# Altium schematic sheet Register.SchDoc
size A; Author: E. Sims; Organization: Let's Build Rockets Inc.; SheetNumber: 5; SheetTotal: 11
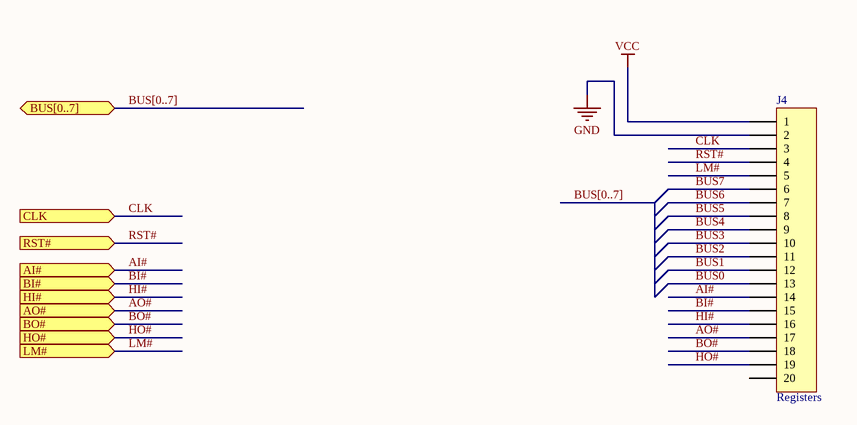
[diagram p0: Register.SchDoc]

## Parts
J4  Registers  [HDR1X20]

## Ports
AI# (in), AO# (in), BI# (in), BO# (in), BUS[0..7] (bidir), CLK (in), HI# (in), HO# (in), LM# (in), RST# (in)

## Nets
GND: J4.2
VCC: J4.1
AI#: J4.14 ; port AI#
AO#: J4.17 ; port AO#
BI#: J4.15 ; port BI#
BO#: J4.18 ; port BO#
BUS0: J4.13
BUS1: J4.12
BUS2: J4.11
BUS3: J4.10
BUS4: J4.9
BUS5: J4.8
BUS6: J4.7
BUS7: J4.6
CLK: J4.3 ; port CLK
HI#: J4.16 ; port HI#
HO#: J4.19 ; port HO#
LM#: J4.5 ; port LM#
RST#: J4.4 ; port RST#

Not connected (* = marked no-connect by the designer): J4 20

## Buses and harness runs
bus BUS[0..7]
bus BUS[0..7] = port BUS[0..7]

## Notes on the sheet
- Let's Build Rocket's Inc. Modular Paylaod System Based on TMP-010 Rev
  For more information visit https://github.com/LetsBuildRockets/Modular-Payload-System
  This work is licensed under CC BY-NC 4.0. To view a copy of this license, visit https://creativecommons.org/licenses/by-nc/4.0
- Title
- Size:
- Date:
- Assembly Variant:
- B
- Number:
- Time:
- Revision:
- Sheet
- of
- Author:
- File:

## Library data of the parts
J4 = Header 20: Header, 20-Pin; System: Connector; LatestRevisionDate: 17-Jul-2002; LatestRevisionNote: Re-released for DXP Platform.; Publisher: Altium Limited